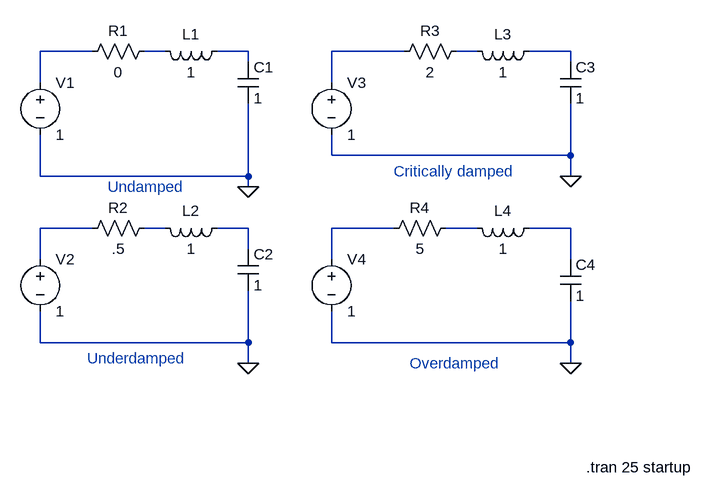
[diagram p0: schematic Damping.asc]
Damping.asc, the LTspice schematic file:
Version 4
SHEET 1 1028 688
WIRE 80 32 0 32
WIRE 192 32 160 32
WIRE 320 32 272 32
WIRE 560 32 448 32
WIRE 672 32 640 32
WIRE 816 32 752 32
WIRE 320 48 320 32
WIRE 816 48 816 32
WIRE 0 80 0 32
WIRE 448 80 448 32
WIRE 448 192 448 160
WIRE 816 192 816 112
WIRE 816 192 448 192
WIRE 0 224 0 160
WIRE 320 224 320 112
WIRE 320 224 0 224
WIRE 816 224 816 192
WIRE 320 240 320 224
WIRE 80 304 0 304
WIRE 192 304 160 304
WIRE 320 304 272 304
WIRE 544 304 448 304
WIRE 672 304 624 304
WIRE 816 304 752 304
WIRE 320 336 320 304
WIRE 0 352 0 304
WIRE 448 352 448 304
WIRE 816 352 816 304
WIRE 0 480 0 432
WIRE 320 480 320 400
WIRE 320 480 0 480
WIRE 448 480 448 432
WIRE 816 480 816 416
WIRE 816 480 448 480
WIRE 320 512 320 480
WIRE 816 512 816 480
FLAG 816 512 0
FLAG 816 224 0
FLAG 320 240 0
FLAG 320 512 0
SYMBOL voltage 0 64 R0
WINDOW 123 0 0 Left 0
WINDOW 39 0 0 Left 0
SYMATTR InstName V1
SYMATTR Value 1
SYMBOL voltage 0 336 R0
WINDOW 123 0 0 Left 0
WINDOW 39 0 0 Left 0
SYMATTR InstName V2
SYMATTR Value 1
SYMBOL voltage 448 64 R0
WINDOW 123 0 0 Left 0
WINDOW 39 0 0 Left 0
SYMATTR InstName V3
SYMATTR Value 1
SYMBOL voltage 448 336 R0
WINDOW 123 0 0 Left 0
WINDOW 39 0 0 Left 0
SYMATTR InstName V4
SYMATTR Value 1
SYMBOL res 176 16 R90
WINDOW 0 0 56 VBottom 2
WINDOW 3 32 56 VTop 2
SYMATTR InstName R1
SYMATTR Value 0
SYMBOL res 176 288 R90
WINDOW 0 0 56 VBottom 2
WINDOW 3 32 56 VTop 2
SYMATTR InstName R2
SYMATTR Value .5
SYMBOL res 656 16 R90
WINDOW 0 0 56 VBottom 2
WINDOW 3 32 56 VTop 2
SYMATTR InstName R3
SYMATTR Value 2
SYMBOL res 640 288 R90
WINDOW 0 0 56 VBottom 2
WINDOW 3 32 56 VTop 2
SYMATTR InstName R4
SYMATTR Value 5
SYMBOL ind 288 16 R90
WINDOW 0 5 56 VBottom 2
WINDOW 3 32 56 VTop 2
SYMATTR InstName L1
SYMATTR Value 1
SYMBOL ind 288 288 R90
WINDOW 0 5 56 VBottom 2
WINDOW 3 32 56 VTop 2
SYMATTR InstName L2
SYMATTR Value 1
SYMBOL ind 768 16 R90
WINDOW 0 5 56 VBottom 2
WINDOW 3 32 56 VTop 2
SYMATTR InstName L3
SYMATTR Value 1
SYMBOL ind 768 288 R90
WINDOW 0 5 56 VBottom 2
WINDOW 3 32 56 VTop 2
SYMATTR InstName L4
SYMATTR Value 1
SYMBOL cap 304 48 R0
SYMATTR InstName C1
SYMATTR Value 1
SYMBOL cap 304 336 R0
SYMATTR InstName C2
SYMATTR Value 1
SYMBOL cap 800 48 R0
SYMATTR InstName C3
SYMATTR Value 1
SYMBOL cap 800 352 R0
SYMATTR InstName C4
SYMATTR Value 1
TEXT 840 672 Left 2 !.tran 25 startup
TEXT 568 512 Left 2 ;Overdamped
TEXT 104 240 Left 2 ;Undamped
TEXT 72 504 Left 2 ;Underdamped
TEXT 544 216 Left 2 ;Critically damped

The netlist it stands for:
* Damping.asc
V1 N001 0 1
V2 N007 0 1
V3 N004 0 1
V4 N010 0 1
R1 N002 N001 0
R2 N008 N007 .5
R3 N005 N004 2
R4 N011 N010 5
L1 N003 N002 1
L2 N009 N008 1
L3 N006 N005 1
L4 N012 N011 1
C1 N003 0 1
C2 N009 0 1
C3 N006 0 1
C4 N012 0 1
.tran 25 startup
* Overdamped
* Undamped
* Underdamped
* Critically damped
.backanno
.end